# EAGLE design ATtiny badge (EAGLE 7.6.0)
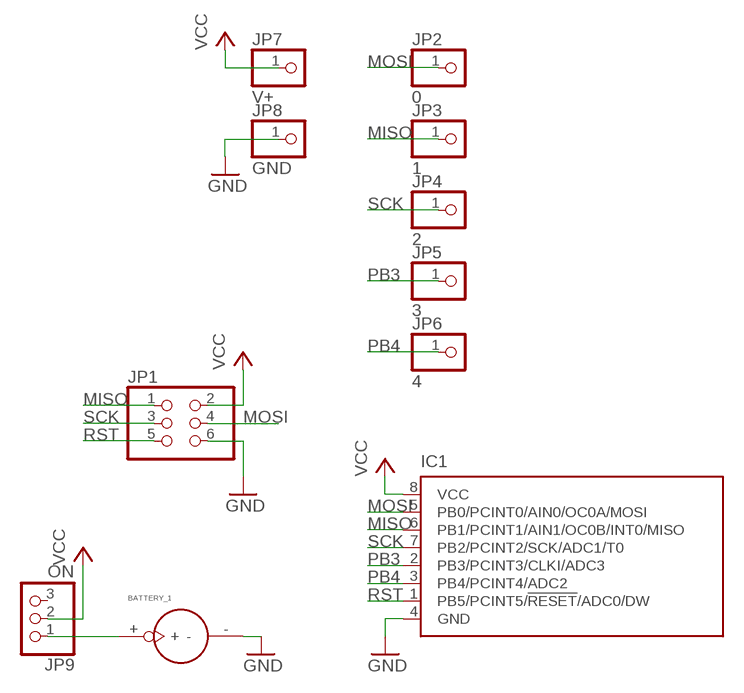
[diagram p0: schematic, sheet 1]

## Parts
BATTERY_1  BATTERY_1236_C  [BATTERY_1236_C]
IC1  TINY13-20SU  [8S2]
JP1  PINHD-2X3  [2X03]
JP2  0  PINHD-1X1  [1X01]
JP3  1  PINHD-1X1  [1X01]
JP4  2  PINHD-1X1  [1X01]
JP5  3  PINHD-1X1  [1X01]
JP6  4  PINHD-1X1  [1X01]
JP7  V+  PINHD-1X1  [1X01]
JP8  GND  PINHD-1X1  [1X01]
JP9  ON  PINHD-1X3  [1X03]

## Nets
GND: BATTERY_1.- IC1.4(GND) JP1.6 JP8.1
MISO: IC1.6(PB1/PCINT1/AIN1/OC0B/INT0/MISO) JP1.1 JP3.1
MOSI: IC1.5(PB0/PCINT0/AIN0/OC0A/MOSI) JP1.4 JP2.1
N$1: BATTERY_1.+ JP9.1
PB3: IC1.2(PB3/PCINT3/CLKI/ADC3) JP5.1
PB4: IC1.3(PB4/PCINT4/ADC2) JP6.1
RST: IC1.1(PB5/PCINT5/!RESET!/ADC0/DW) JP1.5
SCK: IC1.7(PB2/PCINT2/SCK/ADC1/T0) JP1.3 JP4.1
VCC: IC1.8(VCC) JP1.2 JP7.1 JP9.2
Unconnected: JP9.3

## Library data of the parts
BATTERY_1 = Itead_BP_110825.lbr:BATTERY_1236_C: SOC004
IC1 = atmel:TINY13: 8-bit AVR Microcontroller with 1K Bytes In-System Programmable Flash Source: http://www.atmel.com/dyn/resources/prod_documents/2535S.pdf; MPN: ATTINY13-20SU; OC_FARNELL: 9171568; OC_NEWARK: 96K6522
JP1 = pinhead:PINHD-2X3: PIN HEADER
JP2-JP8 = pinhead:PINHD-1X1: PIN HEADER
JP9 = pinhead:PINHD-1X3: PIN HEADER

## Board
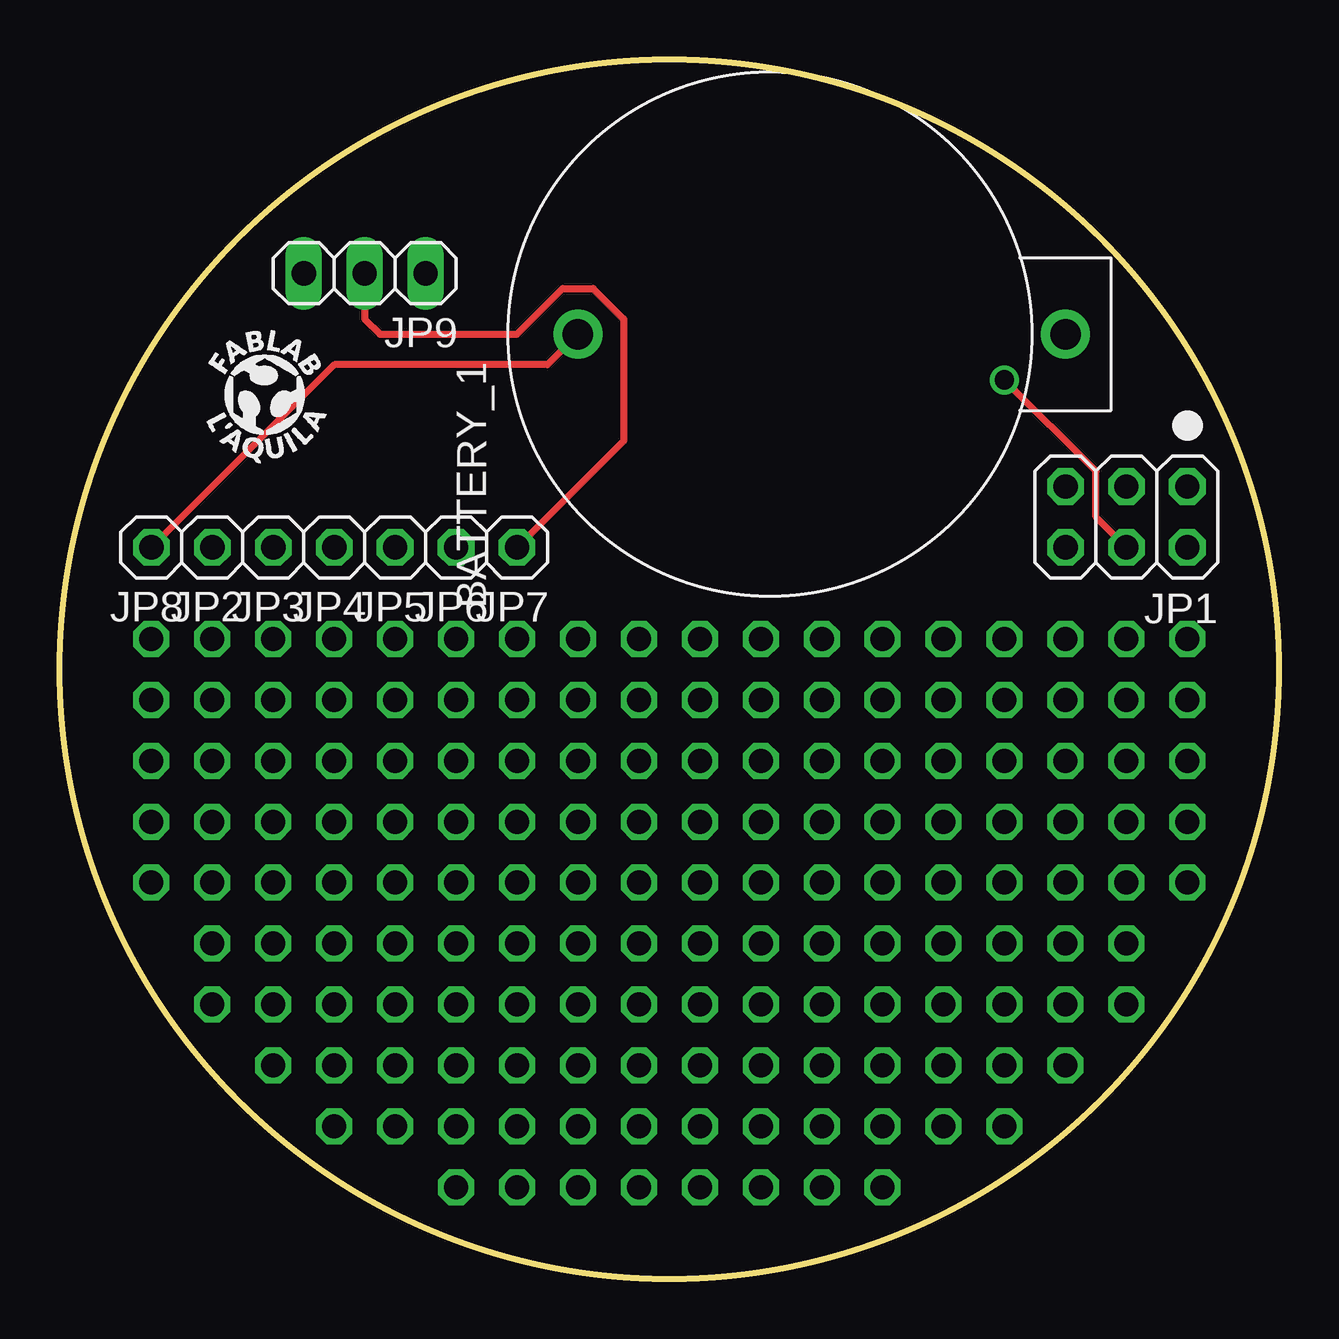
[diagram p1: board, top side]
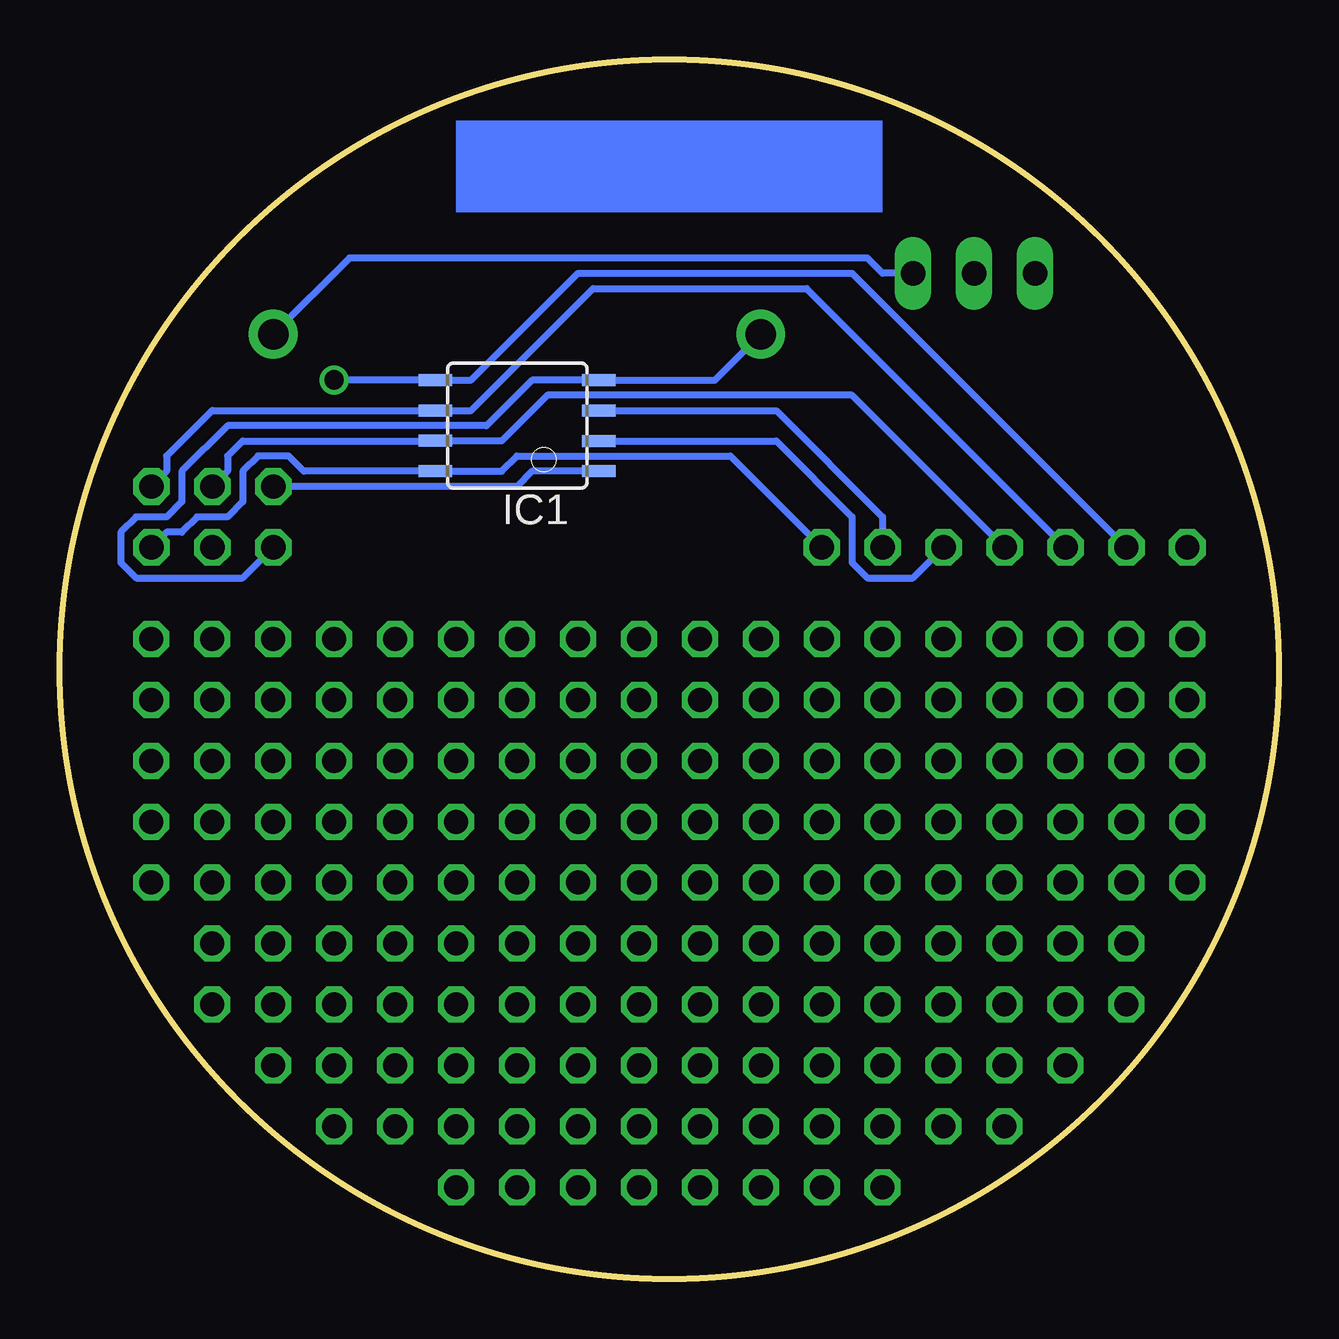
[diagram p2: board, bottom side, seen from below]

Size 50.8 x 50.8 mm. Coordinates in mm from the lower left corner, seen from the top.
Outline: circle at 25.4,25.4 radius 25.4
Copper layers (1*16): Top 0.035mm / dielectric 1.5mm / Bottom 0.035mm
Design rules "default": minimum track width 10mil, minimum drill 24mil, track to track 8mil, track to pad 8mil, pad to pad 8mil, via to via 8mil, smd to smd 8mil, copper to edge 40mil, drill to drill 8mil, minimum pad ring 10mil, minimum via ring 8mil, stop-mask expansion 4mil, vias tented up to drill 0mil, thermal gap 10mil

### Footprints (pad centres in the part's own frame; a part is rotated, then mirrored left to right if it is on the bottom)
BATTERY_1236_C = drill 1.27 pad 2.032: + 0,0; - 0,20.32
8S2 = smd 0.5 x 1.4: 1 -1.905,-3.404; 2 -0.645,-3.404; 3 0.625,-3.404; 4 1.895,-3.404; 5 1.905,3.404; 6 0.635,3.404; 7 -0.635,3.404; 8 -1.905,3.404
2X03 = drill 1.016 octagon: 1 -2.54,-1.27; 2 -2.54,1.27; 3 0,-1.27; 4 0,1.27; 5 2.54,-1.27; 6 2.54,1.27
1X01 = drill 1.016 octagon: 1 0,0
1X03 = drill 1.016 long: 1 -2.54,0; 2 0,0; 3 2.54,0

### Placement (x,y rotation side)
BATTERY_1  41.91,39.37 90 top
IC1  31.75,35.56 90 bottom
JP1  44.45,31.75 180 top
JP2  6.35,30.48 180 top
JP3  8.89,30.48 180 top
JP4  11.43,30.48 180 top
JP5  13.97,30.48 180 top
JP6  16.51,30.48 180 top
JP7  19.05,30.48 180 top
JP8  3.81,30.48 180 top
JP9  12.7,41.91 180 top

### Tracks (layer width: path | path; a pad name or v marks a point on that pad's centre or on a via)
GND
  Top 0.3: BATTERY_1.- 20.32,38.1 11.43,38.1 JP8.1
  Bottom 0.3: BATTERY_1.- 23.5,37.45 IC1.4 31.12,37.45 33.02,35.56 43.81,35.56 45.72,33.66 45.72,32.38 46.35,31.75 47.62,31.75 48.26,31.11 48.26,29.84 47.62,29.21 43.18,29.21 JP1.6
MISO
  Bottom 0.3: JP3.1 19.68,41.27 28.57,41.27 33.66,36.2 IC1.6 44.45,36.2 46.35,34.29 46.35,33.66 JP1.1
MOSI  (via drill 0.8)
  Top 0.3: JP1.4 43.18,31.75 43.18,33.66 v39.37,37.47
  Bottom 0.3: JP2.1 17.78,41.91 29.21,41.91 33.66,37.47 IC1.5 v39.37,37.47
N$1
  Bottom 0.3: JP9.1 16.51,41.91 17.14,42.55 38.73,42.55 BATTERY_1.+
N$4  (via drill 1)
  other vias: 29.21,3.81
N$5  (via drill 1)
  other vias: 26.67,3.81
N$6  (via drill 1)
  other vias: 24.13,3.81
N$7  (via drill 1)
  other vias: 21.59,3.81
N$8  (via drill 1)
  other vias: 19.05,3.81
N$9  (via drill 1)
  other vias: 16.51,3.81
N$16  (via drill 1)
  other vias: 31.75,3.81
N$17  (via drill 1)
  other vias: 34.29,3.81
N$22  (via drill 1)
  other vias: 39.37,6.35
N$24  (via drill 1)
  other vias: 41.91,8.89
N$26  (via drill 1)
  other vias: 44.45,11.43
N$35  (via drill 1)
  other vias: 46.99,26.67
N$36  (via drill 1)
  other vias: 46.99,24.13
N$37  (via drill 1)
  other vias: 46.99,21.59
N$38  (via drill 1)
  other vias: 46.99,19.05
N$39  (via drill 1)
  other vias: 46.99,16.51
N$40  (via drill 1)
  other vias: 44.45,16.51
N$41  (via drill 1)
  other vias: 44.45,13.97
N$42  (via drill 1)
  other vias: 41.91,13.97
N$43  (via drill 1)
  other vias: 41.91,11.43
N$44  (via drill 1)
  other vias: 39.37,11.43
N$45  (via drill 1)
  other vias: 39.37,8.89
N$46  (via drill 1)
  other vias: 36.83,8.89
N$47  (via drill 1)
  other vias: 36.83,6.35
N$48  (via drill 1)
  other vias: 13.97,6.35
N$49  (via drill 1)
  other vias: 11.43,6.35
N$55  (via drill 1)
  other vias: 8.89,8.89
N$56  (via drill 1)
  other vias: 6.35,11.43
N$69  (via drill 1)
  other vias: 3.81,26.67
N$70  (via drill 1)
  other vias: 3.81,24.13
N$71  (via drill 1)
  other vias: 3.81,21.59
N$72  (via drill 1)
  other vias: 3.81,19.05
N$73  (via drill 1)
  other vias: 3.81,16.51
N$74  (via drill 1)
  other vias: 6.35,16.51
N$75  (via drill 1)
  other vias: 6.35,13.97
N$76  (via drill 1)
  other vias: 6.35,19.05
N$77  (via drill 1)
  other vias: 6.35,21.59
N$78  (via drill 1)
  other vias: 6.35,24.13
N$79  (via drill 1)
  other vias: 6.35,26.67
N$80  (via drill 1)
  other vias: 8.89,26.67
N$81  (via drill 1)
  other vias: 8.89,24.13
N$82  (via drill 1)
  other vias: 8.89,21.59
N$83  (via drill 1)
  other vias: 8.89,19.05
N$84  (via drill 1)
  other vias: 8.89,16.51
N$85  (via drill 1)
  other vias: 8.89,13.97
N$86  (via drill 1)
  other vias: 8.89,11.43
N$87  (via drill 1)
  other vias: 11.43,11.43
N$88  (via drill 1)
  other vias: 11.43,8.89
N$89  (via drill 1)
  other vias: 13.97,8.89
N$90  (via drill 1)
  other vias: 13.97,11.43
N$91  (via drill 1)
  other vias: 11.43,13.97
N$92  (via drill 1)
  other vias: 13.97,13.97
N$93  (via drill 1)
  other vias: 13.97,16.51
N$94  (via drill 1)
  other vias: 11.43,16.51
N$95  (via drill 1)
  other vias: 11.43,19.05
N$96  (via drill 1)
  other vias: 13.97,19.05
N$97  (via drill 1)
  other vias: 16.51,6.35
N$98  (via drill 1)
  other vias: 19.05,6.35
N$99  (via drill 1)
  other vias: 21.59,6.35
N$100  (via drill 1)
  other vias: 24.13,6.35
N$101  (via drill 1)
  other vias: 26.67,6.35
N$102  (via drill 1)
  other vias: 29.21,6.35
N$103  (via drill 1)
  other vias: 31.75,6.35
N$104  (via drill 1)
  other vias: 34.29,6.35
N$105  (via drill 1)
  other vias: 34.29,8.89
N$106  (via drill 1)
  other vias: 31.75,8.89
N$107  (via drill 1)
  other vias: 29.21,8.89
N$108  (via drill 1)
  other vias: 26.67,8.89
N$109  (via drill 1)
  other vias: 24.13,8.89
N$110  (via drill 1)
  other vias: 21.59,8.89
N$111  (via drill 1)
  other vias: 19.05,8.89
N$112  (via drill 1)
  other vias: 16.51,8.89
N$113  (via drill 1)
  other vias: 16.51,11.43
N$114  (via drill 1)
  other vias: 19.05,11.43
N$115  (via drill 1)
  other vias: 21.59,11.43
N$116  (via drill 1)
  other vias: 24.13,11.43
N$117  (via drill 1)
  other vias: 26.67,11.43
N$118  (via drill 1)
  other vias: 29.21,11.43
N$119  (via drill 1)
  other vias: 31.75,11.43
N$120  (via drill 1)
  other vias: 34.29,11.43
N$121  (via drill 1)
  other vias: 36.83,11.43
N$122  (via drill 1)
  other vias: 36.83,13.97
N$123  (via drill 1)
  other vias: 39.37,13.97
N$124  (via drill 1)
  other vias: 39.37,16.51
N$125  (via drill 1)
  other vias: 41.91,16.51
N$126  (via drill 1)
  other vias: 41.91,19.05
N$127  (via drill 1)
  other vias: 44.45,19.05
N$128  (via drill 1)
  other vias: 44.45,21.59
N$129  (via drill 1)
  other vias: 41.91,21.59
N$130  (via drill 1)
  other vias: 41.91,24.13
N$131  (via drill 1)
  other vias: 44.45,24.13
N$132  (via drill 1)
  other vias: 44.45,26.67
N$133  (via drill 1)
  other vias: 41.91,26.67
N$134  (via drill 1)
  other vias: 39.37,26.67
N$135  (via drill 1)
  other vias: 39.37,24.13
N$136  (via drill 1)
  other vias: 39.37,21.59
N$137  (via drill 1)
  other vias: 39.37,19.05
N$138  (via drill 1)
  other vias: 36.83,19.05
N$139  (via drill 1)
  other vias: 36.83,16.51
N$140  (via drill 1)
  other vias: 36.83,21.59
N$141  (via drill 1)
  other vias: 36.83,24.13
N$142  (via drill 1)
  other vias: 36.83,26.67
N$143  (via drill 1)
  other vias: 34.29,26.67
N$144  (via drill 1)
  other vias: 31.75,26.67
N$145  (via drill 1)
  other vias: 29.21,26.67
N$146  (via drill 1)
  other vias: 26.67,26.67
N$147  (via drill 1)
  other vias: 24.13,26.67
N$148  (via drill 1)
  other vias: 21.59,26.67
N$149  (via drill 1)
  other vias: 19.05,26.67
N$150  (via drill 1)
  other vias: 16.51,26.67
N$151  (via drill 1)
  other vias: 13.97,26.67
N$152  (via drill 1)
  other vias: 11.43,26.67
N$153  (via drill 1)
  other vias: 11.43,24.13
N$154  (via drill 1)
  other vias: 11.43,21.59
N$155  (via drill 1)
  other vias: 13.97,21.59
N$156  (via drill 1)
  other vias: 13.97,24.13
N$157  (via drill 1)
  other vias: 34.29,24.13
N$158  (via drill 1)
  other vias: 31.75,24.13
N$159  (via drill 1)
  other vias: 29.21,24.13
N$160  (via drill 1)
  other vias: 26.67,24.13
N$161  (via drill 1)
  other vias: 24.13,24.13
N$162  (via drill 1)
  other vias: 21.59,24.13
N$163  (via drill 1)
  other vias: 19.05,24.13
N$164  (via drill 1)
  other vias: 16.51,24.13
N$165  (via drill 1)
  other vias: 16.51,21.59
N$166  (via drill 1)
  other vias: 16.51,19.05
N$167  (via drill 1)
  other vias: 16.51,16.51
N$168  (via drill 1)
  other vias: 16.51,13.97
N$169  (via drill 1)
  other vias: 19.05,13.97
N$170  (via drill 1)
  other vias: 19.05,16.51
N$171  (via drill 1)
  other vias: 19.05,19.05
N$172  (via drill 1)
  other vias: 19.05,21.59
N$173  (via drill 1)
  other vias: 21.59,21.59
N$174  (via drill 1)
  other vias: 24.13,21.59
N$175  (via drill 1)
  other vias: 26.67,21.59
N$176  (via drill 1)
  other vias: 29.21,21.59
N$177  (via drill 1)
  other vias: 31.75,21.59
N$178  (via drill 1)
  other vias: 34.29,21.59
N$179  (via drill 1)
  other vias: 34.29,19.05
N$180  (via drill 1)
  other vias: 31.75,19.05
N$181  (via drill 1)
  other vias: 29.21,19.05
N$182  (via drill 1)
  other vias: 26.67,19.05
N$183  (via drill 1)
  other vias: 24.13,19.05
N$184  (via drill 1)
  other vias: 21.59,19.05
N$185  (via drill 1)
  other vias: 21.59,16.51
N$186  (via drill 1)
  other vias: 21.59,13.97
N$187  (via drill 1)
  other vias: 24.13,13.97
N$188  (via drill 1)
  other vias: 24.13,16.51
N$189  (via drill 1)
  other vias: 26.67,16.51
N$190  (via drill 1)
  other vias: 26.67,13.97
N$191  (via drill 1)
  other vias: 29.21,13.97
N$192  (via drill 1)
  other vias: 29.21,16.51
N$193  (via drill 1)
  other vias: 31.75,16.51
N$194  (via drill 1)
  other vias: 31.75,13.97
N$195  (via drill 1)
  other vias: 34.29,13.97
N$196  (via drill 1)
  other vias: 34.29,16.51
PB3
  Bottom 0.3: IC1.2 20.95,34.91 17.78,31.75 17.78,29.84 17.14,29.21 15.24,29.21 JP5.1
PB4
  Bottom 0.3: IC1.3 20.95,36.19 16.51,31.75 JP6.1
RST
  Bottom 0.3: IC1.1 31.11,33.66 31.75,33.02 JP1.5
SCK
  Bottom 0.3: JP4.1 17.78,36.83 30.48,36.83 32.38,34.92 IC1.7 43.18,34.92 43.81,34.29 43.81,33.66 JP1.3
VCC
  Top 0.3: JP7.1 23.5,34.92 23.5,40.01 22.23,41.27 20.95,41.27 19.05,39.37 13.34,39.37 12.7,40.01 JP9.2
  Bottom 0.3: JP7.1 22.86,34.29 31.75,34.29 32.38,33.66 IC1.8 40.64,33.66 41.27,34.29 42.55,34.29 43.18,33.66 43.18,32.38 43.81,31.75 45.09,31.75 45.72,31.11 46.35,31.11 JP1.2
(copper drawn outside any net)
  shapes: Bottom area x1